# EAGLE design AVS (EAGLE 5.10)
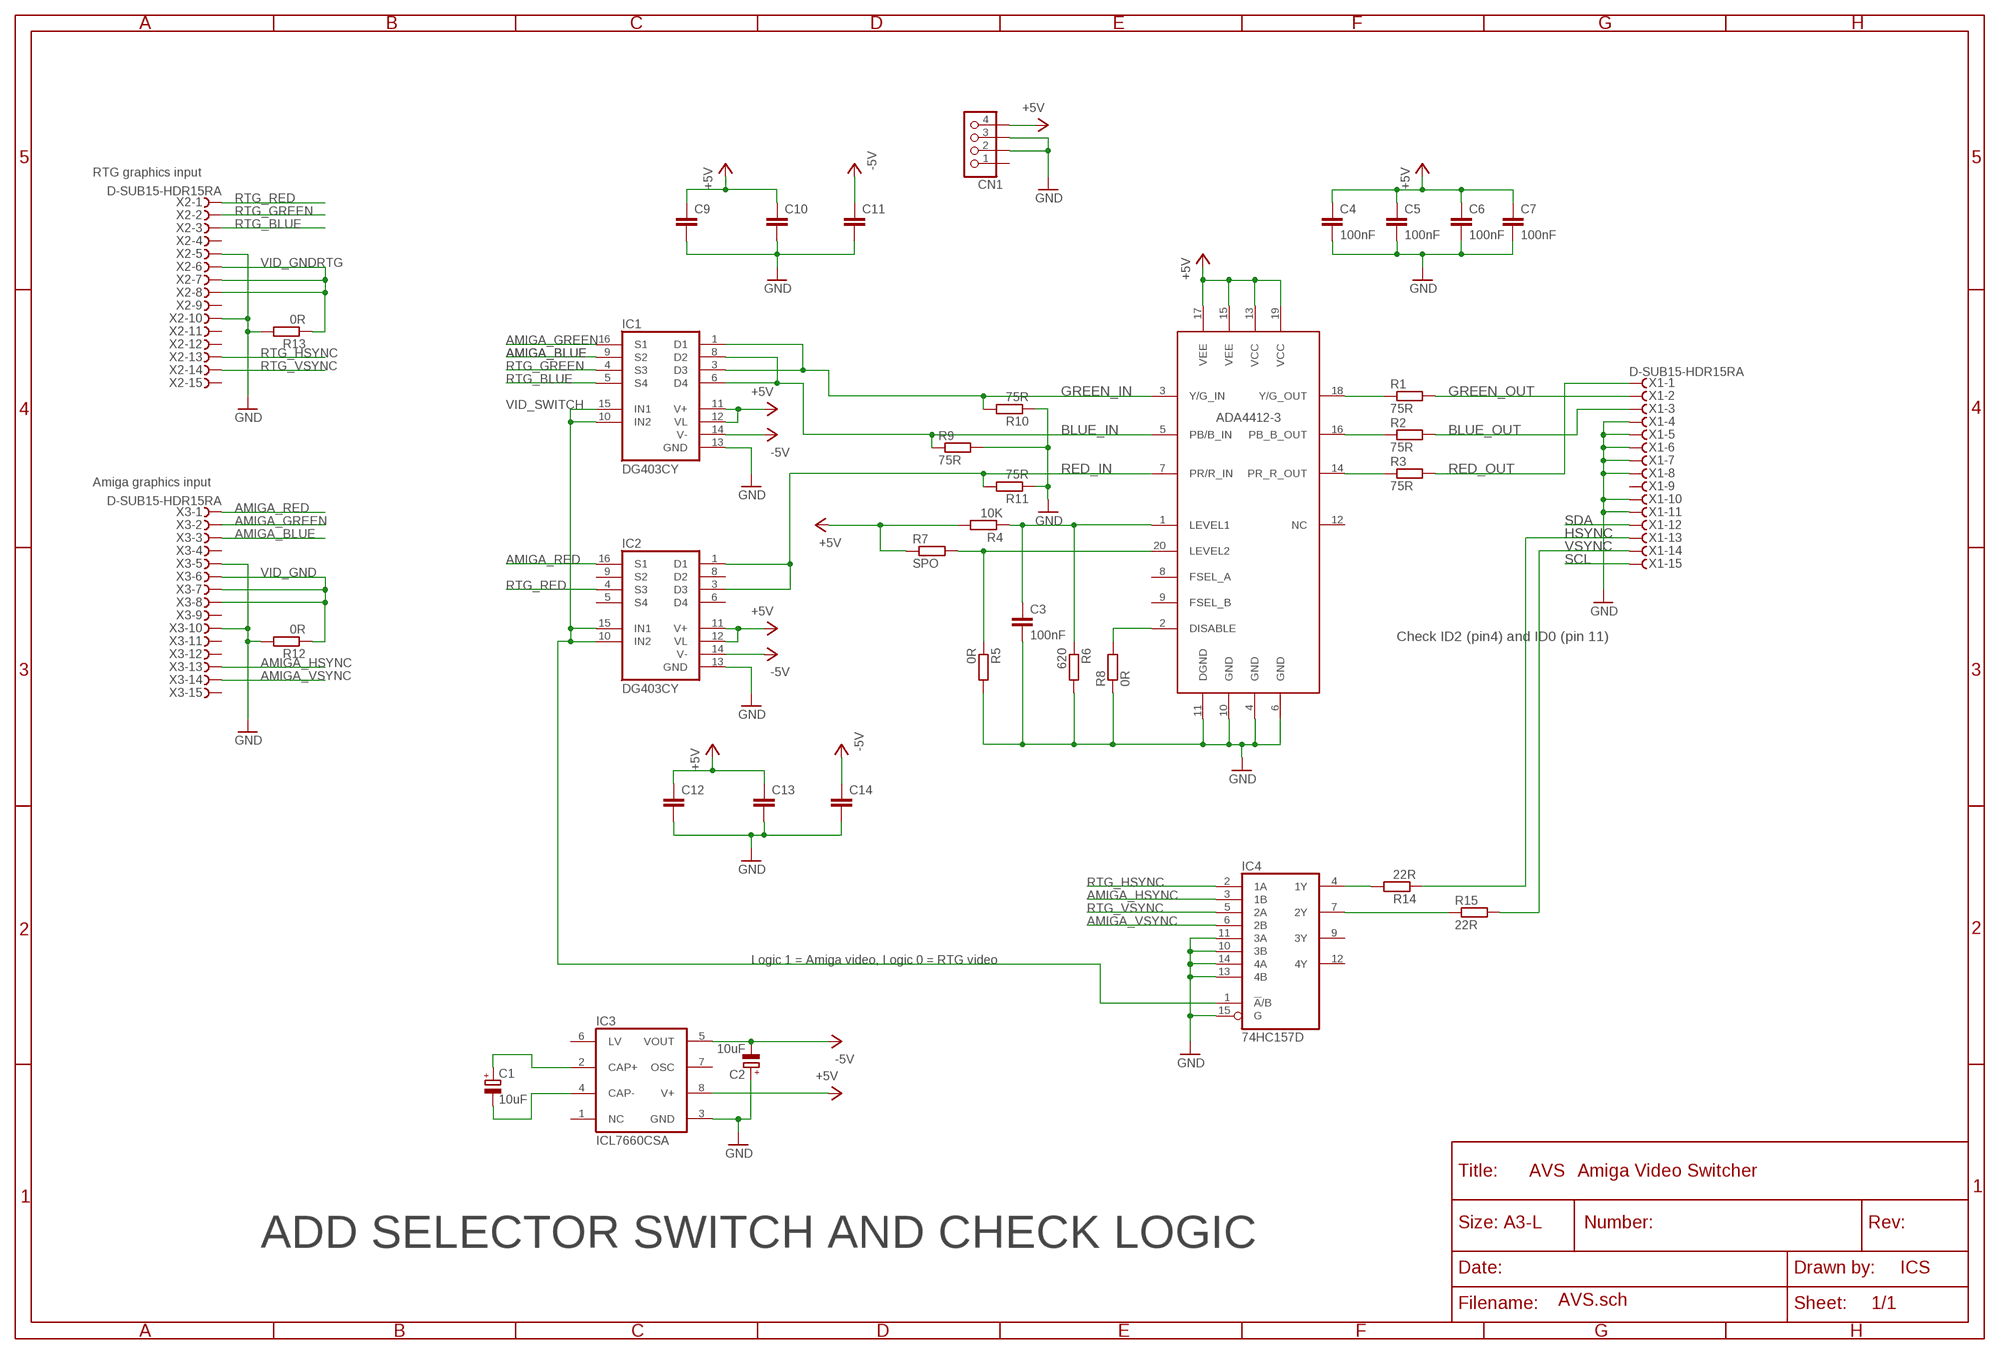
[diagram p0: schematic, sheet 1]

## Parts
C1  10uF  CPOL-EUA  [PANASONIC_A]
C2  10uF  CPOL-EUA  [PANASONIC_A]
C3  100nF  C-EUC0805  [C0805]
C4  100nF  C-EUC0805  [C0805]
C5  100nF  C-EUC0805  [C0805]
C6  100nF  C-EUC0805  [C0805]
C7  100nF  C-EUC0805  [C0805]
C9  C-EUC0805  [C0805]
C10  C-EUC0805  [C0805]
C11  C-EUC0805  [C0805]
C12  C-EUC0805  [C0805]
C13  C-EUC0805  [C0805]
C14  C-EUC0805  [C0805]
CN1  FLOPPY_RA  [FLOPPYPOWER__RA]
IC1  DG403CY  [SO16]
IC2  DG403CY  [SO16]
IC3  ICL7660CSA  [SO08]
IC4  74HC157D  [SO16]
R1  75R  R-EU_R0805  [R0805]
R2  75R  R-EU_R0805  [R0805]
R3  75R  R-EU_R0805  [R0805]
R4  10K  R-EU_R0805  [R0805]
R5  0R  R-EU_R0805  [R0805]
R6  620  R-EU_R0805  [R0805]
R7  SPO  R-EU_R0805  [R0805]
R8  0R  R-EU_R0805  [R0805]
R9  75R  R-EU_R0805  [R0805]
R10  75R  R-EU_R0805  [R0805]
R11  75R  R-EU_R0805  [R0805]
R12  0R  R-EU_R0805  [R0805]
R13  0R  R-EU_R0805  [R0805]
R14  22R  R-EU_R0805  [R0805]
R15  22R  R-EU_R0805  [R0805]
U1  ADA4412-3  [QSOP16]
X1  D-SUB15-HDR15RA  [HDR15RA]
X2  D-SUB15-HDR15RA  [HDR15RA]
X3  D-SUB15-HDR15RA  [HDR15RA]

## Nets
+5V: C4.1 C5.1 C6.1 C7.1 C9.1 C10.1 C12.1 C13.1 CN1.4(+5V) IC1.11(V+) IC1.12(VL) IC2.11(V+) IC2.12(VL) IC3.8(V+) R4.2 R7.1 U1.13(VCC) U1.15(VEE) U1.17(VEE) U1.19(VCC)
-5V: C2.- C11.1 C14.1 IC1.14(V-) IC2.14(V-) IC3.5(VOUT)
AMIGA_BLUE: IC1.9(S2) X3.3
AMIGA_GREEN: IC1.16(S1) X3.2
AMIGA_HSYNC: IC4.3(1B) X3.13
AMIGA_RED: IC2.16(S1) X3.1
AMIGA_VSYNC: IC4.6(2B) X3.14
BLUE_IN: IC1.6(D4) IC1.8(D2) R9.1 U1.5(PB/B_IN)
BLUE_OUT: R2.2 X1.3
GND: C2.+ C3.2 C4.2 C5.2 C6.2 C7.2 C9.2 C10.2 C11.2 C12.2 C13.2 C14.2 CN1.2(GND) CN1.3(GND) IC1.13(GND) IC2.13(GND) IC3.3(GND) IC4.10(3B) IC4.11(3A) IC4.13(4B) IC4.14(4A) IC4.15(G) R5.2 R6.2 R8.1 R9.2 R10.1 R11.1 R12.2 R13.2 U1.4(GND) U1.6(GND) U1.10(GND) U1.11(DGND) X1.4 X1.5 X1.6 X1.7 X1.8 X1.10 X1.11 X2.5 X2.10 X3.5 X3.10
GREEN_IN: IC1.1(D1) IC1.3(D3) R10.2 U1.3(Y/G_IN)
GREEN_OUT: R1.2 X1.2
HSYNC: R14.1 X1.13
N$1: C1.+ IC3.2(CAP+)
N$2: C1.- IC3.4(CAP-)
N$4: R8.2 U1.2(DISABLE)
N$5: C3.1 R4.1 R6.1 U1.1(LEVEL1)
N$6: R5.1 R7.2 U1.20(LEVEL2)
N$7: R1.1 U1.18(Y/G_OUT)
N$8: R2.1 U1.16(PB_B_OUT)
N$9: R3.1 U1.14(PR_R_OUT)
N$10: IC4.7(2Y) R15.1
N$11: IC4.4(1Y) R14.2
RED_IN: IC2.1(D1) IC2.3(D3) R11.2 U1.7(PR/R_IN)
RED_OUT: R3.2 X1.1
RTG_BLUE: IC1.5(S4) X2.3
RTG_GREEN: IC1.4(S3) X2.2
RTG_HSYNC: IC4.2(1A) X2.13
RTG_RED: IC2.4(S3) X2.1
RTG_VSYNC: IC4.5(2A) X2.14
SCL: X1.15
SDA: X1.12
VID_GND: R12.1 X3.6 X3.7 X3.8
VID_GNDRTG: R13.1
VID_SWITCH: IC1.10(IN2) IC1.15(IN1) IC2.10(IN2) IC2.15(IN1) IC4.1(!A!/B)
VSYNC: R15.2 X1.14
Unconnected: CN1.1(+12V) IC2.5(S4) IC2.6(D4) IC2.8(D2) IC2.9(S2) IC3.1(NC) IC3.6(LV) IC3.7(OSC) IC4.9(3Y) IC4.12(4Y) U1.8(FSEL_A) U1.9(FSEL_B) U1.12(NC) X1.9 X2.4 X2.6 X2.7 X2.8 X2.9 X2.11 X2.12 X2.15 X3.4 X3.9 X3.11 X3.12 X3.15

## Notes on the sheet
- RTG graphics input
- Amiga graphics input
- Check ID2 (pin4) and ID0 (pin 11)
- Logic 1 = Amiga video, Logic 0 = RTG video
- Amiga Video Switcher
- ADD SELECTOR SWITCH AND CHECK LOGIC
- ICS
- AVS.sch

## Power pins joined to a net without a drawn wire
GND: IC4.8(GND)
VCC: IC4.16(VCC)

## Library data of the parts
C1 C2 = rcl:CPOL-EU: POLARIZED CAPACITOR, European symbol
C3-C7 C9-C14 = rcl:C-EU: CAPACITOR, European symbol
CN1 = IANS:FLOPPY_RA
IC1 IC2 = maxim:DG403CY: ANALOG SWITCH
IC3 = maxim-6b:ICL7660CSA: VOLTAGE CONVERTER
IC4 = 74xx-eu:74*157: Quadruple 2-line to 1-line data SELECTOR/MULTIPLEXER
R1-R15 = rcl:R-EU_: RESISTOR, European symbol
U1 = IANS:ADA4412-3
X1-X3 = con-thomas-betts:D-SUB15-: D-Subminiatur Connector Source: Electronioc Interconnects European Edition 1998

## Board
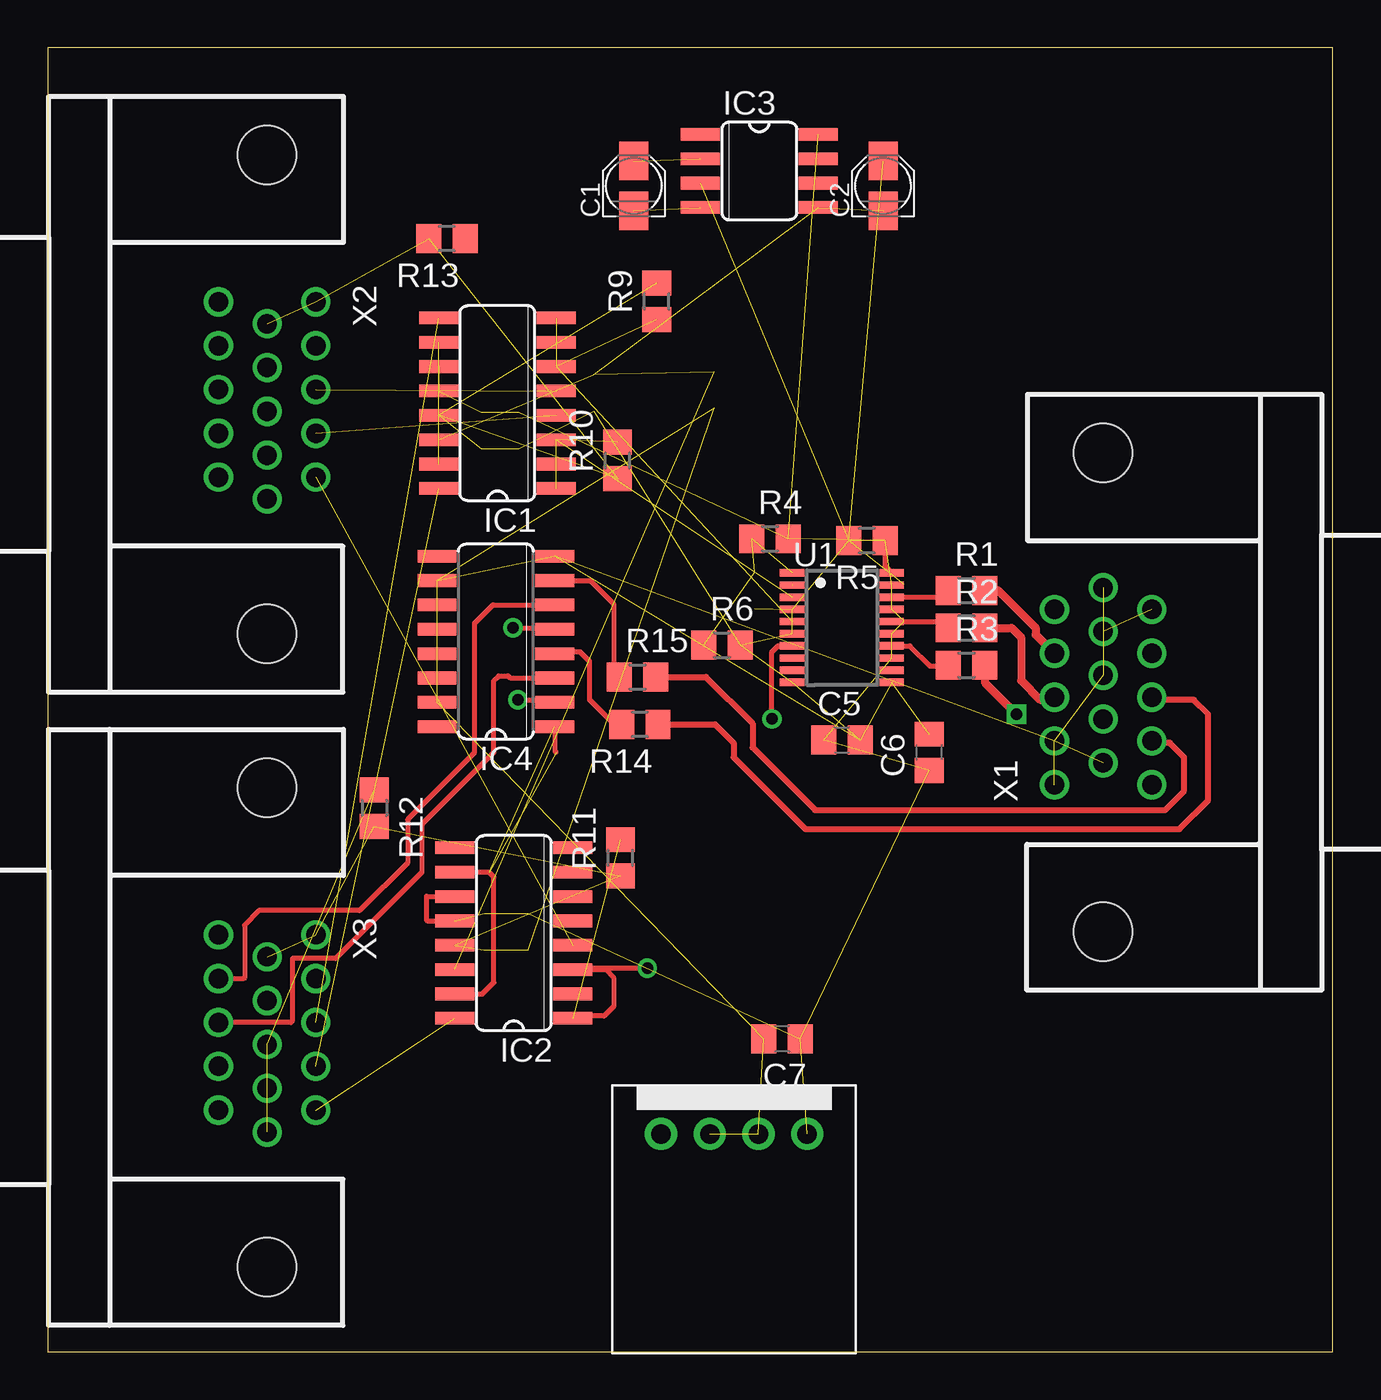
[diagram p1: board, top side]
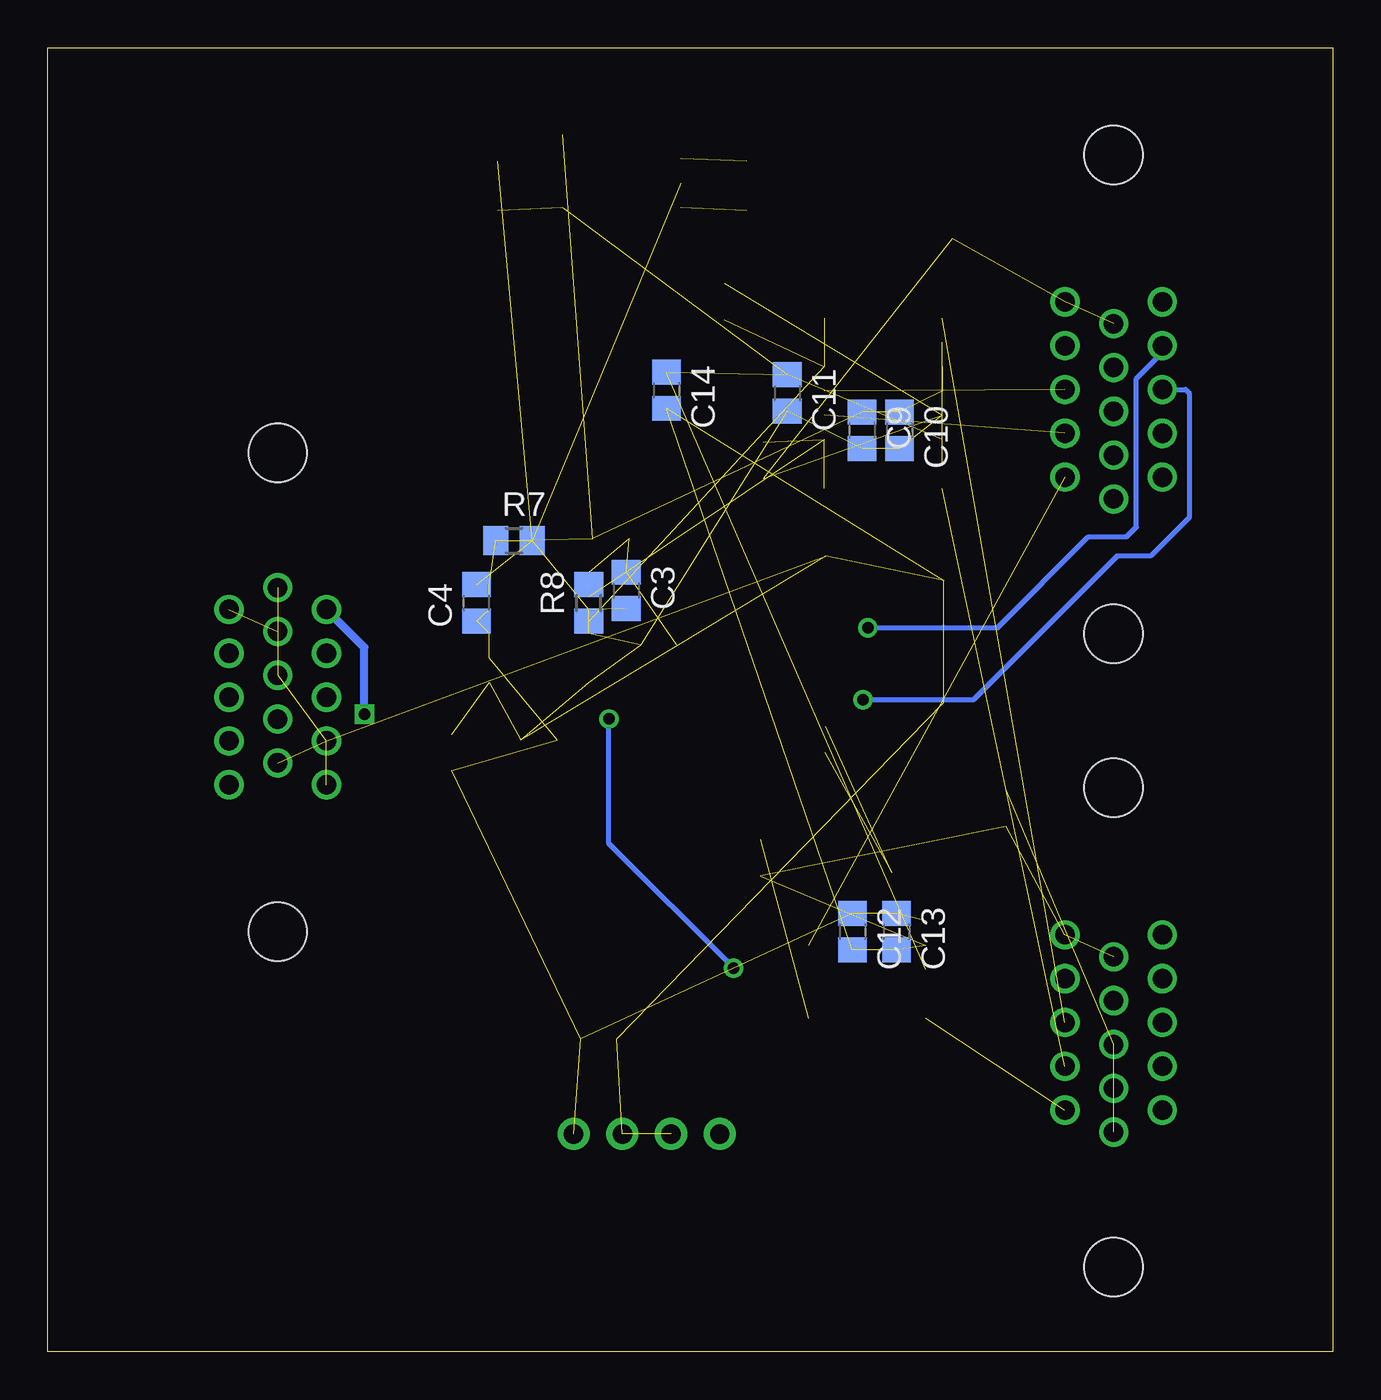
[diagram p2: board, bottom side, seen from below]

Size 67 x 68 mm. Coordinates in mm from the lower left corner, seen from the top.
Outline: 0,0 67,0 67,68 0,68 0,0
Copper layers (1*16): Top 0.035mm / dielectric 1.5mm / Bottom 0.035mm
Design rules "default": minimum track width 10mil, minimum drill 24mil, track to track 8mil, track to pad 8mil, pad to pad 8mil, via to via 8mil, smd to smd 8mil, copper to edge 40mil, drill to drill 8mil, minimum pad ring 10mil, minimum via ring 8mil, stop-mask expansion 4mil, vias tented up to drill 0mil, thermal gap 10mil

### Footprints (pad centres in the part's own frame; a part is rotated, then mirrored left to right if it is on the bottom)
PANASONIC_A = smd 2 x 1.5: + 1.3,0; - -1.3,0
C0805 = smd 1.3 x 1.5: 1 -0.95,0; 2 0.95,0
FLOPPYPOWER__RA = drill 1.016 pad 1.676 round: 1 0,5.08; 2 0,2.54; 3 0,0; 4 0,-2.54
SO16 = smd 0.66 x 2.032: 1 -4.445,-3.073; 2 -3.175,-3.073; 3 -1.905,-3.073; 4 -0.635,-3.073; 5 0.635,-3.073; 6 1.905,-3.073; 7 3.175,-3.073; 8 4.445,-3.073; 9 4.445,3.073; 10 3.175,3.073; 11 1.905,3.073; 12 0.635,3.073; 13 -0.635,3.073; 14 -1.905,3.073; 15 -3.175,3.073; 16 -4.445,3.073
SO08 = smd 0.66 x 2.032: 1 -1.905,-3.073; 2 -0.635,-3.073; 3 0.635,-3.073; 4 1.905,-3.073; 5 1.905,3.073; 6 0.635,3.073; 7 -0.635,3.073; 8 -1.905,3.073
R0805 = smd 1.3 x 1.5: 1 -0.95,0; 2 0.95,0
QSOP16 = smd 0.381 x 1.27: 1 -2.223,-2.6; 2 -1.587,-2.6; 3 -0.953,-2.6; 4 -0.318,-2.6; 5 0.318,-2.6; 6 0.953,-2.6; 7 1.587,-2.6; 8 2.223,-2.6; 9 2.857,-2.6; 10 3.493,-2.6; 11 3.493,2.6; 12 2.857,2.6; 13 2.223,2.6; 14 1.587,2.6; 15 0.953,2.6; 16 0.318,2.6; 17 -0.318,2.6; 18 -0.953,2.6; 19 -1.587,2.6; 20 -2.223,2.6
HDR15RA = drill 1.016 round: 1 4.318,2.54; 2 2.032,2.54; 3 -0.254,2.54; 4 -2.54,2.54; 5 -4.826,2.54; 6 5.461,0; 7 3.175,0; 8 0.889,0; 9 -1.397,0; 10 -3.683,0; 11 4.318,-2.54; 12 2.032,-2.54; 13 -0.254,-2.54; 14 -2.54,-2.54; 15 -4.826,-2.54 | hole 3.048: -12.497,0; 12.497,0

### Placement (x,y rotation side)
C1  30.55,60.8 90 top
C2  43.55,60.8 90 top
C3  36.85,39.7 270 bottom
C4  44.65,39.05 90 bottom
C5  41.4,31.9 0 top
C6  45.95,31.25 90 top
C7  38.28,16.31 180 top
C9  24.55,48.05 270 bottom
C10  22.6,48.05 270 bottom
C11  28.45,50 270 bottom
C12  25.05,21.9 270 bottom
C13  22.75,21.9 270 bottom
C14  34.75,50.15 270 bottom
CN1  37.05,11.35 90 top
IC1  23.44,49.47 90 top
IC2  24.29,21.83 90 top
IC3  37.09,61.58 270 top
IC4  23.36,37.04 90 top
R1  47.9,39.7 0 top
R2  47.9,37.75 0 top
R3  47.9,35.8 0 top
R4  37.65,42.4 0 top
R5  42.7,42.3 180 top
R6  35.15,36.85 0 top
R7  42.7,42.3 0 bottom
R8  38.8,39.05 90 bottom
R9  31.74,54.78 90 top
R10  29.7,46.48 90 top
R11  29.85,25.75 90 top
R12  17.02,28.35 270 top
R13  20.8,58.05 180 top
R14  30.86,32.71 180 top
R15  30.74,35.19 0 top
U1  41.4,38.4 270 top
X1  55.02,34.39 90 top
X2  11.43,49.93 270 top
X3  11.43,16.91 270 top

### Tracks (layer width: path | path; a pad name or v marks a point on that pad's centre or on a via)
+5V  (18 unrouted)
  Top 0.254: IC2.12 19.79,22.47 19.75,22.5 19.75,23.75 21.2,23.75 IC2.11
-5V  (5 unrouted)
AMIGA_BLUE  (1 unrouted)
AMIGA_GREEN  (1 unrouted)
AMIGA_HSYNC
  Top 0.254: IC4.3 24.11,35.13 24,35.25 23.5,35.25 23.25,35 23.25,31.25 19.5,27.5 19.5,25 15,20.5 12.75,20.5 12.75,17.25 12.66,17.16 X3.13
AMIGA_RED  (1 unrouted)
AMIGA_VSYNC
  Top 0.254: IC4.6 23.2,38.95 22.25,38 22.25,31.25 18.75,27.75 18.75,25.5 16.25,23 11,23 10.25,22.25 10.25,19.5 10.2,19.45 X3.14
BLUE_IN  (3 unrouted)
BLUE_OUT
  Top 0.406: R2.2 50.25,37.75 50.75,37.25 50.75,35 51.75,34 52.34,34 X1.3
GND  (45 unrouted)
GREEN_IN  (3 unrouted)
GREEN_OUT
  Top 0.406: R1.2 49.55,39.7 51.5,37.75 51.5,37.4 X1.2
HSYNC
  Top 0.305: R14.1 34.79,32.71 35.75,31.75 35.75,31 39.5,27.25 59,27.25 60.5,28.75 60.5,33.25 59.75,34 57.7,34 X1.13
N$1  (1 unrouted)
N$2  (1 unrouted)
N$4  (1 unrouted)
N$5  (3 unrouted)
N$6  (1 unrouted)
  Top 0.254: R5.1 43.65,40.97 U1.20
N$7
  Top 0.254: U1.18 46.6,39.35 R1.1
N$8
  Top 0.254: U1.16 46.62,38.08 R2.1
N$9
  Top 0.254: U1.14 44.94,36.81 46,35.75 46.9,35.75 R3.1
N$10
  Top 0.254: IC4.7 28.29,40.22 29.5,39 29.5,35.48 R15.1
N$11
  Top 0.254: R14.2 29.54,32.71 28.25,34 28.25,36 27.75,36.5 26.53,36.5 IC4.4
RED_IN  (via drill 0.6)  (1 unrouted)
  Top 0.254: U1.7 38.06,36.81 37.75,36.5 v37.75,33 | v31.25,20 27.44,20 IC2.3 29.07,19.92 29.5,19.5 29.5,18 29,17.5 27.48,17.5 IC2.1
  Bottom 0.254: v37.75,33 37.75,26.5 v31.25,20
RED_OUT  (via drill 0.6)
  Top 0.406: R3.2 48.85,34.9 v50.5,33.25
  Bottom 0.406: v50.5,33.25 50.5,36.73 X1.1
RTG_BLUE  (1 unrouted)
RTG_GREEN  (1 unrouted)
RTG_HSYNC  (via drill 0.6)
  Top 0.254: v24.5,34 26.3,34 IC4.2
  Bottom 0.254: X2.13 7.68,50.18 7.5,50 7.5,43.5 9.5,41.5 11.25,41.5 18.75,34 v24.5,34
RTG_RED  (1 unrouted)
RTG_VSYNC  (via drill 0.6)
  Top 0.254: v24.25,37.75 26.36,37.75 IC4.5
  Bottom 0.254: X2.14 8.89,52.11 10.25,50.75 10.25,43 10.75,42.5 12.75,42.5 17.5,37.75 v24.25,37.75
VID_GND  (3 unrouted)
VID_SWITCH  (3 unrouted)
  Top 0.254: IC2.15 22.66,18.66 23.25,19.25 23.25,24.75 23,25 IC2.10 | IC4.1 26.43,31.32 26.5,31.25
VSYNC
  Top 0.305: R15.2 34.31,35.19 36.75,32.75 36.75,31.5 40,28.25 58.25,28.25 59.25,29.25 59.25,31 58.5,31.75 57.66,31.75 X1.14